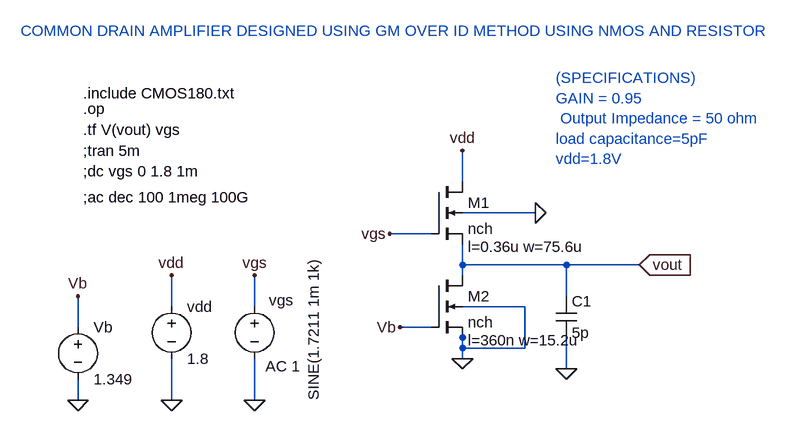
[diagram p0: schematic Assignment_CD.asc]
Assignment_CD.asc, the LTspice schematic file:
Version 4
SHEET 1 880 680
WIRE 320 128 320 80
WIRE 432 176 320 176
WIRE 272 208 208 208
WIRE 320 256 320 224
WIRE 480 256 320 256
WIRE 592 256 480 256
WIRE 320 272 320 256
WIRE 480 304 480 256
WIRE -128 320 -128 272
WIRE 0 320 0 272
WIRE 416 320 320 320
WIRE -272 352 -272 304
WIRE 272 352 224 352
WIRE 320 368 320 352
WIRE 320 384 320 368
WIRE 416 384 416 320
WIRE 416 384 320 384
WIRE 320 400 320 384
WIRE 480 416 480 368
WIRE -272 464 -272 432
WIRE -128 464 -128 400
WIRE 0 464 0 400
FLAG 0 464 0
FLAG -128 464 0
FLAG -128 272 vdd
FLAG 0 272 vgs
FLAG 208 208 vgs
FLAG 320 80 vdd
FLAG 592 256 vout
IOPIN 592 256 In
FLAG 480 416 0
FLAG 432 176 0
FLAG 224 352 Vb
FLAG -272 464 0
FLAG -272 304 Vb
FLAG 320 400 0
SYMBOL nmos4 272 128 R0
WINDOW 123 56 100 Left 2
SYMATTR Value2 l=0.36u w=75.6u
SYMATTR InstName M1
SYMATTR Value nch
SYMBOL voltage -128 304 R0
WINDOW 123 0 0 Left 0
WINDOW 39 0 0 Left 0
SYMATTR InstName vdd
SYMATTR Value 1.8
SYMBOL voltage 0 304 R0
WINDOW 123 17 108 Left 2
WINDOW 39 0 0 Left 0
WINDOW 3 91 -58 VRight 2
WINDOW 0 22 6 Left 2
SYMATTR Value2 AC 1
SYMATTR Value SINE(1.7211 1m 1k)
SYMATTR InstName vgs
SYMBOL cap 464 304 R0
SYMATTR InstName C1
SYMATTR Value 5p
SYMBOL nmos4 272 272 R0
WINDOW 123 56 100 Left 2
SYMATTR Value2 l=360n w=15.2u
SYMATTR InstName M2
SYMATTR Value nch
SYMBOL voltage -272 336 R0
WINDOW 123 0 0 Left 0
WINDOW 39 0 0 Left 0
SYMATTR InstName Vb
SYMATTR Value 1.349
TEXT -264 -8 Left 2 !.include CMOS180.txt
TEXT -264 16 Left 2 !.op
TEXT -264 48 Left 2 !.tf V(vout) vgs
TEXT -264 80 Left 2 !;tran 5m
TEXT -264 112 Left 2 !;dc vgs 0 1.8 1m
TEXT 464 -32 Left 2 ;(SPECIFICATIONS)\nGAIN = 0.95\n Output Impedance = 50 ohm\nload capacitance=5pF\nvdd=1.8V
TEXT -360 -104 Left 2 ;COMMON DRAIN AMPLIFIER DESIGNED USING GM OVER ID METHOD USING NMOS AND RESISTOR
TEXT -264 152 Left 2 !;ac dec 100 1meg 100G

The netlist it stands for:
* Assignment_CD.asc
M1 vdd vgs vout 0 nch l=0.36u w=75.6u
vdd vdd 0 1.8
vgs vgs 0 SINE(1.7211 1m 1k) AC 1
C1 vout 0 5p
M2 vout Vb 0 0 nch l=360n w=15.2u
Vb Vb 0 1.349
.model NMOS NMOS
.model PMOS PMOS
.lib standard.mos
.include CMOS180.txt
.op
.tf V(vout) vgs
;tran 5m
;dc vgs 0 1.8 1m
* (SPECIFICATIONS)
* GAIN = 0.95
*  Output Impedance = 50 ohm
* load capacitance=5pF
* vdd=1.8V
* COMMON DRAIN AMPLIFIER DESIGNED USING GM OVER ID METHOD USING NMOS AND RESISTOR
;ac dec 100 1meg 100G
.backanno
.end